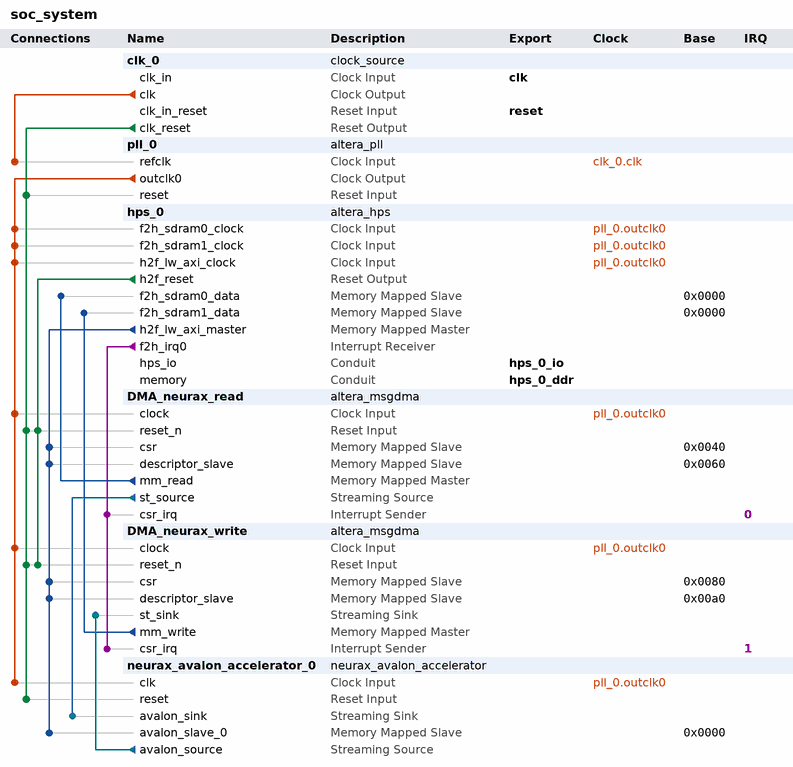
[diagram p0: system contents]
# Platform Designer (Qsys) system soc_system, Cyclone V 5CSEMA5F31C6
# Parameters at their usual value, and those the tool derives, are not listed.
package require -exact qsys 24.1
create_system soc_system
set_project_property DEVICE_FAMILY {Cyclone V}
set_project_property DEVICE 5CSEMA5F31C6

add_instance clk_0 clock_source 24.1
set_instance_parameter_value clk_0 clockFrequency 50000000

add_instance pll_0 altera_pll 24.1
set_instance_parameter_value pll_0 gui_device_speed_grade 1
set_instance_parameter_value pll_0 gui_number_of_clocks 1
set_instance_parameter_value pll_0 gui_operation_mode direct
set_instance_parameter_value pll_0 gui_output_clock_frequency0 50.0
set_instance_parameter_value pll_0 gui_pll_mode {Integer-N PLL}
set_instance_parameter_value pll_0 gui_reference_clock_frequency 50.0
set_instance_parameter_value pll_0 gui_use_locked false

add_instance hps_0 altera_hps 24.1
set_instance_parameter_value hps_0 EMAC1_Mode RGMII
set_instance_parameter_value hps_0 EMAC1_PinMuxing {HPS I/O Set 0}
set_instance_parameter_value hps_0 F2SCLK_COLDRST_Enable false
set_instance_parameter_value hps_0 F2SCLK_DBGRST_Enable false
set_instance_parameter_value hps_0 F2SCLK_WARMRST_Enable false
set_instance_parameter_value hps_0 F2SDRAM_Type {Avalon-MM Read-Only,Avalon-MM Write-Only}
set_instance_parameter_value hps_0 F2SDRAM_Width 64,64
set_instance_parameter_value hps_0 F2SINTERRUPT_Enable true
set_instance_parameter_value hps_0 F2S_Width 0
set_instance_parameter_value hps_0 FPGA_PERIPHERAL_OUTPUT_CLOCK_FREQ_EMAC0_GTX_CLK 125
set_instance_parameter_value hps_0 FPGA_PERIPHERAL_OUTPUT_CLOCK_FREQ_EMAC0_MD_CLK 2.5
set_instance_parameter_value hps_0 FPGA_PERIPHERAL_OUTPUT_CLOCK_FREQ_EMAC1_GTX_CLK 125
set_instance_parameter_value hps_0 FPGA_PERIPHERAL_OUTPUT_CLOCK_FREQ_EMAC1_MD_CLK 2.5
set_instance_parameter_value hps_0 HPS_PROTOCOL DDR3
set_instance_parameter_value hps_0 I2C0_Mode N/A
set_instance_parameter_value hps_0 I2C0_PinMuxing Unused
set_instance_parameter_value hps_0 I2C1_Mode N/A
set_instance_parameter_value hps_0 I2C1_PinMuxing Unused
set_instance_parameter_value hps_0 LWH2F_Enable true
set_instance_parameter_value hps_0 MEM_BANKADDR_WIDTH 3
set_instance_parameter_value hps_0 MEM_CLK_FREQ 400.0
set_instance_parameter_value hps_0 MEM_COL_ADDR_WIDTH 10
set_instance_parameter_value hps_0 MEM_DQ_WIDTH 32
set_instance_parameter_value hps_0 MEM_DRV_STR RZQ/7
set_instance_parameter_value hps_0 MEM_ROW_ADDR_WIDTH 15
set_instance_parameter_value hps_0 MEM_RTT_NOM RZQ/4
set_instance_parameter_value hps_0 MEM_RTT_WR RZQ/4
set_instance_parameter_value hps_0 MEM_TCL 11
set_instance_parameter_value hps_0 MEM_TFAW_NS 30.0
set_instance_parameter_value hps_0 MEM_TRAS_NS 35.0
set_instance_parameter_value hps_0 MEM_TRCD_NS 13.75
set_instance_parameter_value hps_0 MEM_TRFC_NS 260.0
set_instance_parameter_value hps_0 MEM_TRP_NS 13.75
set_instance_parameter_value hps_0 MEM_VENDOR Other
set_instance_parameter_value hps_0 MEM_WTCL 8
set_instance_parameter_value hps_0 QSPI_Mode N/A
set_instance_parameter_value hps_0 QSPI_PinMuxing Unused
set_instance_parameter_value hps_0 REF_CLK_FREQ 25.0
set_instance_parameter_value hps_0 S2FCLK_USER2CLK 5
set_instance_parameter_value hps_0 S2F_Width 0
set_instance_parameter_value hps_0 SDIO_Mode {4-bit Data}
set_instance_parameter_value hps_0 SDIO_PinMuxing {HPS I/O Set 0}
set_instance_parameter_value hps_0 SPIM1_Mode N/A
set_instance_parameter_value hps_0 SPIM1_PinMuxing Unused
set_instance_parameter_value hps_0 STM_Enable false
set_instance_parameter_value hps_0 TIMING_BOARD_AC_SKEW 0.02
set_instance_parameter_value hps_0 TIMING_BOARD_AC_TO_CK_SKEW 0.01
set_instance_parameter_value hps_0 TIMING_BOARD_DQ_TO_DQS_SKEW 0.05
set_instance_parameter_value hps_0 TIMING_BOARD_MAX_CK_DELAY 0.03
set_instance_parameter_value hps_0 TIMING_BOARD_MAX_DQS_DELAY 0.02
set_instance_parameter_value hps_0 TIMING_BOARD_SKEW_BETWEEN_DQS 0.06
set_instance_parameter_value hps_0 TIMING_BOARD_SKEW_CKDQS_DIMM_MAX 0.12
set_instance_parameter_value hps_0 TIMING_BOARD_SKEW_CKDQS_DIMM_MIN 0.06
set_instance_parameter_value hps_0 TIMING_BOARD_SKEW_WITHIN_DQS 0.01
set_instance_parameter_value hps_0 TIMING_TDH 65
set_instance_parameter_value hps_0 TIMING_TDQSCK 255
set_instance_parameter_value hps_0 TIMING_TDQSQ 125
set_instance_parameter_value hps_0 TIMING_TDS 30
set_instance_parameter_value hps_0 TIMING_TIH 140
set_instance_parameter_value hps_0 TIMING_TIS 180
set_instance_parameter_value hps_0 TIMING_TQSH 0.4
set_instance_parameter_value hps_0 UART0_Mode {No Flow Control}
set_instance_parameter_value hps_0 UART0_PinMuxing {HPS I/O Set 0}
set_instance_parameter_value hps_0 USB1_Mode N/A
set_instance_parameter_value hps_0 USB1_PinMuxing Unused
set_instance_parameter_value hps_0 desired_cfg_clk_mhz 100.0
set_instance_parameter_value hps_0 desired_qspi_clk_mhz 400.0

add_instance DMA_neurax_read altera_msgdma 24.1
set_instance_parameter_value DMA_neurax_read BURST_ENABLE 0
set_instance_parameter_value DMA_neurax_read CHANNEL_ENABLE 1
set_instance_parameter_value DMA_neurax_read CHANNEL_WIDTH 1
set_instance_parameter_value DMA_neurax_read DATA_FIFO_DEPTH 2048
set_instance_parameter_value DMA_neurax_read DATA_WIDTH 32
set_instance_parameter_value DMA_neurax_read DESCRIPTOR_FIFO_DEPTH 256
set_instance_parameter_value DMA_neurax_read ENHANCED_FEATURES 0
set_instance_parameter_value DMA_neurax_read ERROR_ENABLE 1
set_instance_parameter_value DMA_neurax_read ERROR_WIDTH 1
set_instance_parameter_value DMA_neurax_read MAX_BURST_COUNT 2
set_instance_parameter_value DMA_neurax_read MAX_BYTE 4096
set_instance_parameter_value DMA_neurax_read MODE 1
set_instance_parameter_value DMA_neurax_read PACKET_ENABLE 0
set_instance_parameter_value DMA_neurax_read TRANSFER_TYPE {Full Word Accesses Only}

add_instance DMA_neurax_write altera_msgdma 24.1
set_instance_parameter_value DMA_neurax_write BURST_ENABLE 0
set_instance_parameter_value DMA_neurax_write DATA_FIFO_DEPTH 256
set_instance_parameter_value DMA_neurax_write DATA_WIDTH 32
set_instance_parameter_value DMA_neurax_write DESCRIPTOR_FIFO_DEPTH 128
set_instance_parameter_value DMA_neurax_write ENHANCED_FEATURES 0
set_instance_parameter_value DMA_neurax_write ERROR_ENABLE 1
set_instance_parameter_value DMA_neurax_write ERROR_WIDTH 1
set_instance_parameter_value DMA_neurax_write MAX_BURST_COUNT 2
set_instance_parameter_value DMA_neurax_write MAX_BYTE 4096
set_instance_parameter_value DMA_neurax_write MODE 2
set_instance_parameter_value DMA_neurax_write PACKET_ENABLE 1
set_instance_parameter_value DMA_neurax_write TRANSFER_TYPE {Full Word Accesses Only}

add_instance neurax_avalon_accelerator_0 neurax_avalon_accelerator 1.0
set_instance_parameter_value neurax_avalon_accelerator_0 PARALLEL_UNITS 4
set_instance_parameter_value neurax_avalon_accelerator_0 g_ADDR_WIDTH 4
set_instance_parameter_value neurax_avalon_accelerator_0 g_DATA_ADDR_WIDTH 15
set_instance_parameter_value neurax_avalon_accelerator_0 g_FB_HEIGHT 100
set_instance_parameter_value neurax_avalon_accelerator_0 g_FB_WIDTH 100
set_instance_parameter_value neurax_avalon_accelerator_0 g_PIXEL_WIDTH 24
set_instance_parameter_value neurax_avalon_accelerator_0 g_WIDTH 32

# connections
add_connection clk_0.clk pll_0.refclk clock
add_connection pll_0.outclk0 DMA_neurax_read.clock clock
add_connection pll_0.outclk0 DMA_neurax_write.clock clock
add_connection pll_0.outclk0 hps_0.f2h_sdram0_clock clock
add_connection pll_0.outclk0 hps_0.f2h_sdram1_clock clock
add_connection pll_0.outclk0 hps_0.h2f_lw_axi_clock clock
add_connection pll_0.outclk0 neurax_avalon_accelerator_0.clk clock
add_connection clk_0.clk_reset DMA_neurax_read.reset_n reset
add_connection clk_0.clk_reset DMA_neurax_write.reset_n reset
add_connection clk_0.clk_reset neurax_avalon_accelerator_0.reset reset
add_connection clk_0.clk_reset pll_0.reset reset
add_connection hps_0.h2f_reset DMA_neurax_read.reset_n reset
add_connection hps_0.h2f_reset DMA_neurax_write.reset_n reset
add_connection DMA_neurax_read.mm_read hps_0.f2h_sdram0_data avalon
set_connection_parameter_value DMA_neurax_read.mm_read/hps_0.f2h_sdram0_data baseAddress 0x0000
add_connection DMA_neurax_write.mm_write hps_0.f2h_sdram1_data avalon
set_connection_parameter_value DMA_neurax_write.mm_write/hps_0.f2h_sdram1_data baseAddress 0x0000
add_connection hps_0.h2f_lw_axi_master DMA_neurax_read.csr avalon
set_connection_parameter_value hps_0.h2f_lw_axi_master/DMA_neurax_read.csr baseAddress 0x0040
add_connection hps_0.h2f_lw_axi_master DMA_neurax_read.descriptor_slave avalon
set_connection_parameter_value hps_0.h2f_lw_axi_master/DMA_neurax_read.descriptor_slave baseAddress 0x0060
add_connection hps_0.h2f_lw_axi_master DMA_neurax_write.csr avalon
set_connection_parameter_value hps_0.h2f_lw_axi_master/DMA_neurax_write.csr baseAddress 0x0080
add_connection hps_0.h2f_lw_axi_master DMA_neurax_write.descriptor_slave avalon
set_connection_parameter_value hps_0.h2f_lw_axi_master/DMA_neurax_write.descriptor_slave baseAddress 0x00a0
add_connection hps_0.h2f_lw_axi_master neurax_avalon_accelerator_0.avalon_slave_0 avalon
set_connection_parameter_value hps_0.h2f_lw_axi_master/neurax_avalon_accelerator_0.avalon_slave_0 baseAddress 0x0000
add_connection DMA_neurax_read.st_source neurax_avalon_accelerator_0.avalon_sink avalon_streaming
add_connection neurax_avalon_accelerator_0.avalon_source DMA_neurax_write.st_sink avalon_streaming
add_connection hps_0.f2h_irq0 DMA_neurax_read.csr_irq interrupt
set_connection_parameter_value hps_0.f2h_irq0/DMA_neurax_read.csr_irq irqNumber 0
add_connection hps_0.f2h_irq0 DMA_neurax_write.csr_irq interrupt
set_connection_parameter_value hps_0.f2h_irq0/DMA_neurax_write.csr_irq irqNumber 1

# exported interfaces
add_interface clk clock sink
set_interface_property clk EXPORT_OF clk_0.clk_in
add_interface hps_0_ddr conduit end
set_interface_property hps_0_ddr EXPORT_OF hps_0.memory
add_interface hps_0_io conduit end
set_interface_property hps_0_io EXPORT_OF hps_0.hps_io
add_interface reset reset sink
set_interface_property reset EXPORT_OF clk_0.clk_in_reset

set_interconnect_requirement {$system} qsys_mm.clockCrossingAdapter HANDSHAKE
set_interconnect_requirement {$system} qsys_mm.enableEccProtection FALSE
set_interconnect_requirement {$system} qsys_mm.insertDefaultSlave FALSE
set_interconnect_requirement {$system} qsys_mm.maxAdditionalLatency 1

save_system soc_system.qsys
